# Altium schematic sheet 28Pins_schematic.SchDoc (part 1 of 2)
size A2; SheetNumber: 1; SheetTotal: 1
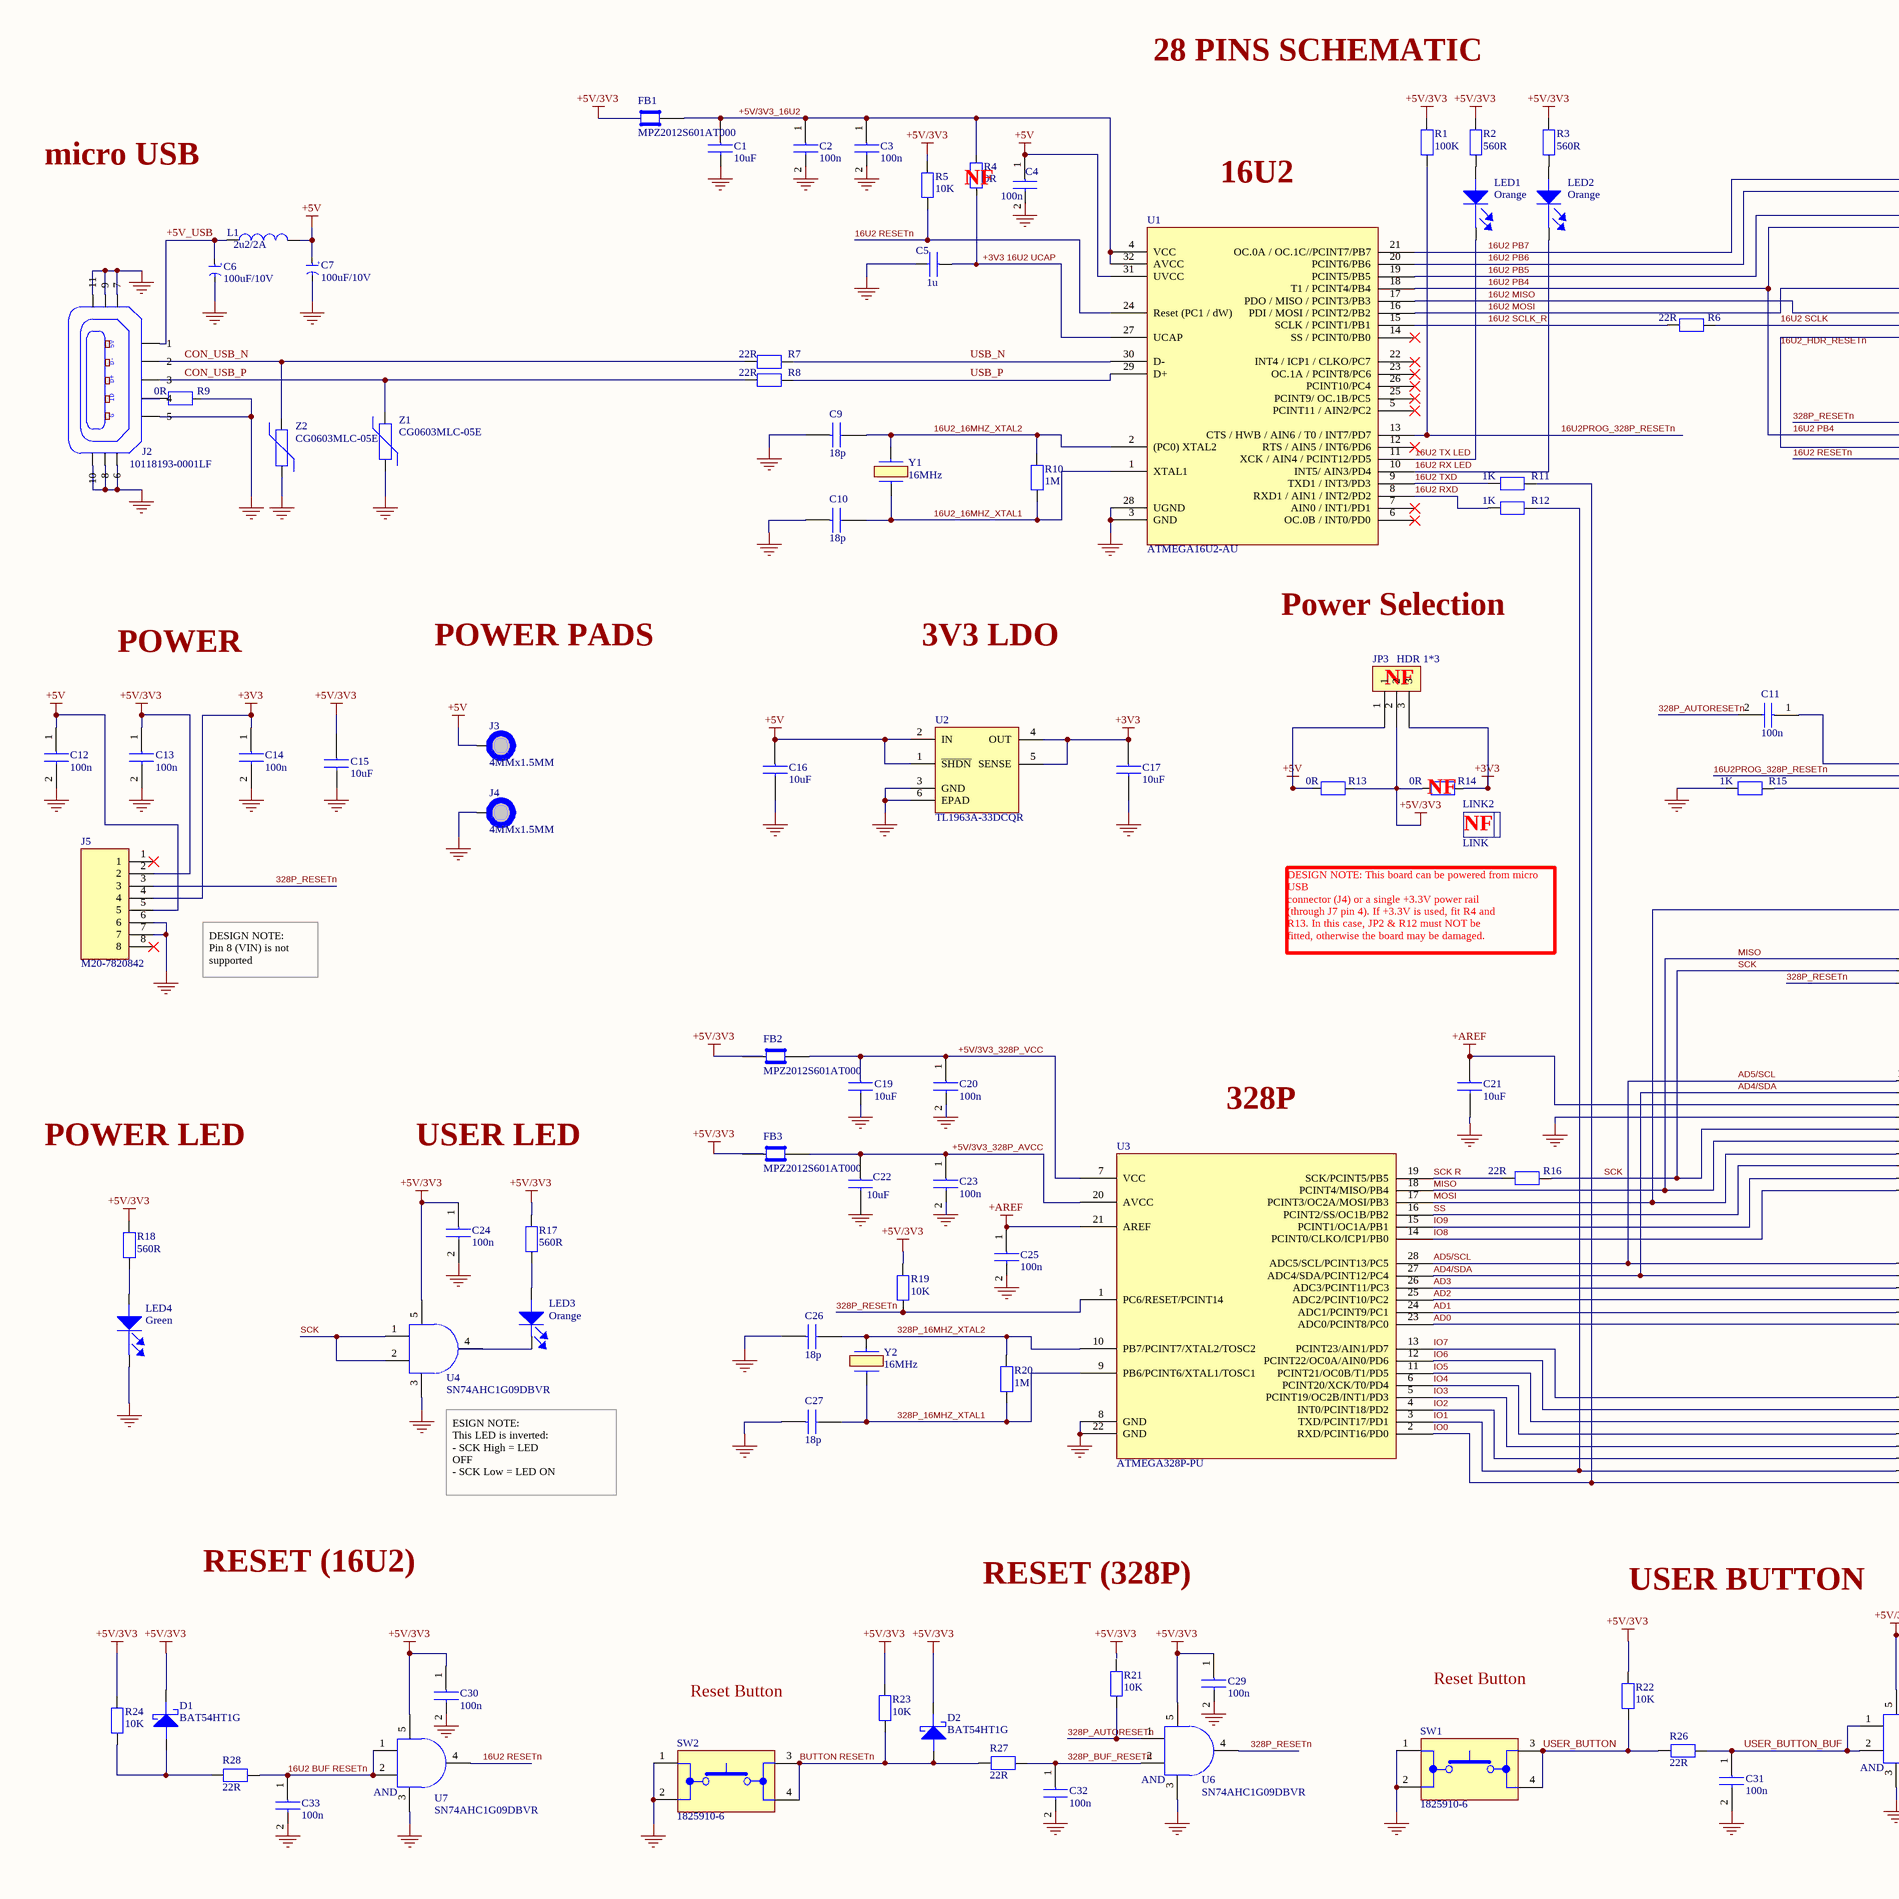
[diagram p0: 28Pins_schematic.SchDoc, left]
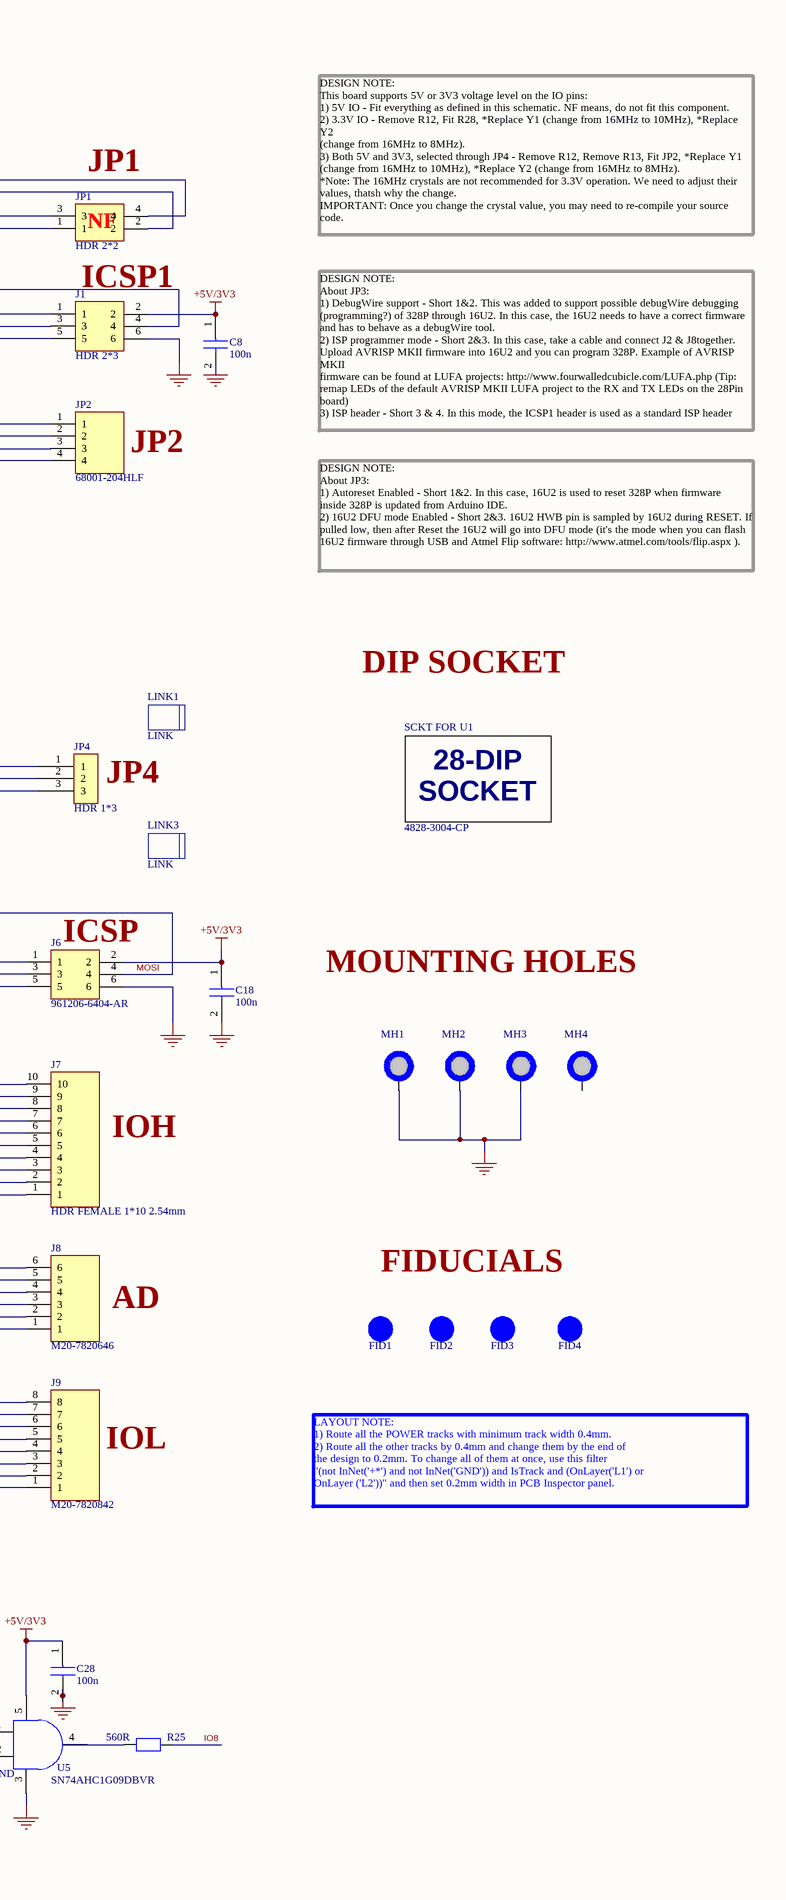
[diagram p1: 28Pins_schematic.SchDoc, right]

## Parts
C1  10uF  [CAP 0805_2012]
C2  100n  [CAPC2012X145N]
C3  100n  [CAPC2012X145N]
C4  100n  [CAPC2012X145N]
C5  1u  [CAP 0805_2012]
C6  100uF/10V  [EEE0GA101SR]
C7  100uF/10V  [EEE0GA101SR]
C8  100n  [CAPC2012X145N]
C9  18p  [CAP 0805_2012]
C10  18p  [CAP 0805_2012]
C11  100n  [CAPC2012X145N]
C12  100n  [CAPC2012X145N]
C13  100n  [CAPC2012X145N]
C14  100n  [CAPC2012X145N]
C15  10uF  [CAP 0805_2012]
C16  10uF  [CAP 0805_2012]
C17  10uF  [CAP 0805_2012]
C18  100n  [CAPC2012X145N]
C19  10uF  [CAP 0805_2012]
C20  100n  [CAPC2012X145N]
C21  10uF  [CAP 0805_2012]
C22  10uF  [CAP 0805_2012]
C23  100n  [CAPC2012X145N]
C24  100n  [CAPC2012X145N]
C25  100n  [CAPC2012X145N]
C26  18p  [CAP 0805_2012]
C27  18p  [CAP 0805_2012]
C28  100n  [CAPC2012X145N]
C29  100n  [CAPC2012X145N]
C30  100n  [CAPC2012X145N]
C31  100n  [CAPC2012X145N]
C32  100n  [CAPC2012X145N]
C33  100n  [CAPC2012X145N]
D1  BAT54HT1G  [SOD323]
D2  BAT54HT1G  [SOD323]
FB1  MPZ2012S601AT000  [FER 0805_2012]
FB2  MPZ2012S601AT000  [FER 0805_2012]
FB3  MPZ2012S601AT000  [FER 0805_2012]
FID1  FID_1MMC  [FID_40x120D]  (value not drawn)  (no BOM)
FID2  FID_1MMC  [FID_40x120D]  (value not drawn)  (no BOM)
FID3  FID_1MMC  [FID_40x120D]  (value not drawn)  (no BOM)
FID4  FID_1MMC  [FID_40x120D]  (value not drawn)  (no BOM)
J1  HDR 2*3  [HDRV6W64P254_2X3_762X500X1130P]
J2  10118193-0001LF  [FCI USB 10118193-0001LF]
J3  4MMx1.5MM  [PAD_WITH_HOLE_5MMx1.5MM]  (no BOM)
J4  4MMx1.5MM  [PAD_WITH_HOLE_5MMx1.5MM]  (no BOM)
J5  M20-7820842  [RHDR8W80P0X254_1X8_2032X254X850P]
J6  961206-6404-AR  [HDRV6W64P254_2X3_762X500X1130P]
J7  HDR FEMALE 1*10 2.54mm  [RHDR10W70P0X254_1X10_2580X250X865P]
J8  M20-7820646  [HDRV6W70P0X254_1X6_1564X250X865P]
J9  M20-7820842  [RHDR8W80P0X254_1X8_2032X254X850P]
JP1  HDR 2*2  [HDRV4W67P254_2X2_508X483X888P]
JP2  68001-204HLF  [HDRV4W67P0X254_1X4_1016X241X858P]
JP3  HDR 1*3  [HDR_1*3_2.54mm]
JP4  HDR 1*3  [HDR_1*3_2.54mm]
L1  2u2/2A  [INDC3225X270N]
LED1  Orange  [SODFL1708X67N]
LED2  Orange  [SODFL1708X67N]
LED3  Orange  [SODFL1708X67N]
LED4  Green  [LEDM178X67N]
LINK1  LINK  (mechanical)
LINK2  LINK  (mechanical)
LINK3  LINK  (mechanical)
MH1  MH_7.4MMC_3.2MMD  [MH_7.4MMD_3.2MMD]  (value not drawn)  (no BOM)
MH2  MH_7.4MMC_3.2MMD  [MH_7.4MMD_3.2MMD]  (value not drawn)  (no BOM)
MH3  MH_7.4MMC_3.2MMD  [MH_7.4MMD_3.2MMD]  (value not drawn)  (no BOM)
MH4  MH_7.4MMNC_3.2MMD  [MH_7.4MMD_3.2MMD_NON_COPPER_NPTH]  (value not drawn)  (no BOM)
R1  100K  [YAGEO RES 0805_2012]
R2  560R  [YAGEO RES 0805_2012]
R3  560R  [YAGEO RES 0805_2012]
R4  0R  [RESC2012X60N]
R5  10K  [CHIP RES_0603_1608]
R6  22R  [YAGEO RES 0805_2012]
R7  22R  [YAGEO RES 0805_2012]
R8  22R  [YAGEO RES 0805_2012]
R9  0R  [YAGEO RES 0805_2012]
R10  1M  [YAGEO RES 0805_2012]
R11  1K  [CHIP RES_0603_1608]
R12  1K  [CHIP RES_0603_1608]
R13  0R  [YAGEO RES 0805_2012]
R14  0R  [YAGEO RES 0805_2012]
R15  1K  [CHIP RES_0603_1608]
R16  22R  [YAGEO RES 0805_2012]
R17  560R  [RESC2012X60N]
R18  560R  [YAGEO RES 0805_2012]
R19  10K  [CHIP RES_0603_1608]
R20  1M  [YAGEO RES 0805_2012]
R21  10K  [CHIP RES_0603_1608]
R22  10K  [CHIP RES_0603_1608]
R23  10K  [CHIP RES_0603_1608]
R24  10K  [CHIP RES_0603_1608]
R25  560R  [RESC2012X60N]
R26  22R  [YAGEO RES 0805_2012]
R27  22R  [YAGEO RES 0805_2012]
R28  22R  [YAGEO RES 0805_2012]
SCKT_FOR_U1  4828-3004-CP  [28_DIP_7.62mm_SOCKET]
SW1  1825910-6  [18259106]
SW2  1825910-6  [18259106]
U1  ATMEGA16U2-AU  [TQFP32]
U2  TL1963A-33DCQR  [SOT127P706X180-6N]
U3  ATMEGA328P-PU  [28_DIP_7.62mm]
U4  SN74AHC1G09DBVR  [SOT95P280X145-5N]
U5  SN74AHC1G09DBVR  [SOT95P280X145-5N]
U6  SN74AHC1G09DBVR  [SOT95P280X145-5N]
U7  SN74AHC1G09DBVR  [SOT95P280X145-5N]
Y1  16MHz  [ABM7]
Y2  16MHz  [ABM7]
Z1  CG0603MLC-05E  [YAGEO RES 0603_1608]
Z2  CG0603MLC-05E  [YAGEO RES 0603_1608]

## Nets
+3V3: C14.1 C17.1 J5.4 JP3.3 R14.2 U2.4(OUT) U2.5(SENSE)
+5V: C4.1 C7.1 C12.1 C16.1 J5.5 JP3.1 L1.2 R13.1 U1.31(UVCC) U2.1(~{SHDN}) U2.2(IN)
+5V/3V3: C8.1 C13.1 C15.1 C18.1 C24.1 C28.1 C29.1 C30.1 D1.2(A) D2.2(A) FB1.2 J1.2 J5.2 J6.2 JP3.2 R1.2 R2.2 R3.2 R5.2 R13.2 R14.1 R17.2 R18.2 R19.2 R22.2 R23.2 R24.2
+AREF: C21.1 C25.1 J7.8 U3.21(AREF)
GND: C5.2 C6.2 C7.2 C8.2 C9.1 C10.1 C12.2 C13.2 C14.2 C16.2 C17.2 C18.2 C19.2 C20.2 C21.2 C23.2 C24.2 C26.1 C27.1 C28.2 C31.2 J1.6 J5.6 J5.7 J6.6 J7.7 LED4.2(A) R9.2 R15.1 SW1.1(COM_1) SW1.2(NO_1) SW2.1(COM_1) SW2.2(NO_1) U1.3(GND) U1.28(UGND) U2.3(GND) U2.6(EPAD) U3.8(GND) U3.22(GND) Z1.1 Z2.1
16U2 BUF RESETn: C33.1 R28.2 U7.1(A) U7.2(B)
16U2 MISO: J1.1 U1.17(PDO_/_MISO_/_PCINT3/PB3)
16U2 MOSI: J1.4 U1.16(PDI_/_MOSI_/_PCINT2/PB2)
16U2 PB4: JP1.1 JP2.2 U1.18(T1_/_PCINT4/PB4)
16U2 PB5: JP1.3 U1.19(PCINT5/PB5)
16U2 PB6: JP1.2 U1.20(PCINT6/PB6)
16U2 PB7: JP1.4 U1.21(OC.0A_/_OC.1C//PCINT7/PB7)
16U2 RESETn: JP2.4 R5.1 U1.24(Reset_(PC1_/_dW))
16U2 RX LED: LED2.2(A) U1.10(INT5/_AIN3/PD4)
16U2 RXD: R12.1 U1.8(RXD1_/_AIN1_/_INT2/PD2)
16U2 SCLK: J1.3 R6.2
16U2 SCLK_R: R6.1 U1.15(SCLK_/_PCINT1/PB1)
16U2 TX LED: LED1.2(A) U1.11(XCK_/_AIN4_/_PCINT12/PD5)
16U2 TXD: R11.1 U1.9(TXD1_/_INT3/PD3)
16U2_16MHZ_XTAL1: C10.2 R10.1 U1.1(XTAL1) Y1.2(X2)
16U2_16MHZ_XTAL2: C9.2 R10.2 U1.2((PC0)_XTAL2) Y1.?1
16U2_HDR_RESETn: J1.5 JP2.3
16U2PROG_328P_RESETn: JP4.2 R1.1 U1.13(CTS_/_HWB_/_AIN6_/_T0_/_INT7/PD7)
328P_16MHZ_XTAL1: C27.2 R20.1 U3.9(PB6/PCINT6/XTAL1/TOSC1) Y2.2(X2)
328P_16MHZ_XTAL2: C26.2 R20.2 U3.10(PB7/PCINT7/XTAL2/TOSC2) Y2.?1
328P_AUTORESETn: C11.2 R21.1 U6.1(A)
328P_BUF_RESETn: C32.1 R27.2 U6.2(B)
328P_RESETn: J5.3 J6.5 JP2.1 R19.1 U3.1(PC6/RESET/PCINT14)
+3V3 16U2 UCAP: C5.1 R4.2 U1.27(UCAP)
+5V/3V3_16U2: C1.1 C2.1 C3.1 FB1.1 R4.1 U1.4(VCC) U1.32(AVCC)
+5V/3V3_328P_AVCC: C22.1 C23.1 FB3.1 U3.20(AVCC)
+5V/3V3_328P_VCC: C19.1 C20.1 FB2.1 U3.7(VCC)
+5V_USB: C6.1 L1.1
AD0: J8.1 U3.23(ADC0/PCINT8/PC0)
AD1: J8.2 U3.24(ADC1/PCINT9/PC1)
AD2: J8.3 U3.25(ADC2/PCINT10/PC2)
AD3: J8.4 U3.26(ADC3/PCINT11/PC3)
AD4/SDA: J7.9 J8.5 U3.27(ADC4/SDA/PCINT12/PC4)
AD5/SCL: J7.10 J8.6 U3.28(ADC5/SCL/PCINT13/PC5)
BUTTON RESETn: D2.1(K) R23.1 R27.1 SW2.3(COM_2) SW2.4(NO_2)
CON_USB_N: R7.1 Z2.2
CON_USB_P: R8.1 Z1.2
IO0: J9.1 R11.2 U3.2(RXD/PCINT16/PD0)
IO1: J9.2 R12.2 U3.3(TXD/PCINT17/PD1)
IO2: J9.3 U3.4(INT0/PCINT18/PD2)
IO3: J9.4 U3.5(PCINT19/OC2B/INT1/PD3)
IO4: J9.5 U3.6(PCINT20/XCK/T0/PD4)
IO5: J9.6 U3.11(PCINT21/OC0B/T1/PD5)
IO6: J9.7 U3.12(PCINT22/OC0A/AIN0/PD6)
IO7: J9.8 U3.13(PCINT23/AIN1/PD7)
IO8: J7.1 R25.2 U3.14(PCINT0/CLKO/ICP1/PB0)
IO9: J7.2 U3.15(PCINT1/OC1A/PB1)
MISO: J6.1 J7.5 U3.18(PCINT4/MISO/PB4)
MOSI: J6.4 J7.4 U3.17(PCINT3/OC2A/MOSI/PB3)
SCK: J6.3 J7.6 R16.2 U4.1(A) U4.2(B)
SCK R: R16.1 U3.19(SCK/PCINT5/PB5)
SS: J7.3 U3.16(PCINT2/SS/OC1B/PB2)
USB_N: R7.2 U1.30(D-)
USB_P: R8.2 U1.29(D+)
USER_BUTTON: R22.1 R26.1 SW1.3(COM_2) SW1.4(NO_2)
USER_BUTTON_BUF: C31.1 R26.2 U5.1(A) U5.2(B)
NetC11_1: C11.1 JP4.1
NetD1_1: D1.1(K) R24.1 R28.1
NetJ2_4: J2.4 R9.1
NetJP4_3: JP4.3 R15.2
NetLED1_1: LED1.1(K) R2.1
NetLED2_1: LED2.1(K) R3.1
NetLED3_1: LED3.1(K) R17.1
NetLED3_2: LED3.2(A) U4.4(Y)
NetLED4_1: LED4.1(K) R18.1
NetR25_1: R25.1 U5.4(Y)

Not connected (* = marked no-connect by the designer): C1 2; C2 2; C3 2; C4 2; C15 2; C22 2; C25 2; C29 2; C30 2; C32 2; C33 2; FB2 2; FB3 2; J2 1 2 3 5 6 7 8 9 10 11; J3 1; J4 1; J5 1* 8*; MH1 1; MH2 1; MH3 1; MH4 1; R21 2; U1 5(PCINT11_/_AIN2/PC2)* 6(OC.0B_/_INT0/PD0)* 7(AIN0_/_INT1/PD1)* 12(RTS_/_AIN5_/_INT6/PD6)* 14(SS_/_PCINT0/PB0)* 22(INT4_/_ICP1_/_CLKO/PC7)* 23(OC.1A_/_PCINT8/PC6)* 25(PCINT9/_OC.1B/PC5)* 26(PCINT10/PC4)*; U4 3(GND) 5(VCC); U5 3(GND) 5(VCC); U6 3(GND) 4(Y) 5(VCC); U7 3(GND) 4(Y) 5(VCC)

## Notes on the sheet
- 28 PINS SCHEMATIC
- micro USB
- (near R4) NF
- 16U2
- (near JP1) JP1
- (near JP1) NF
- DESIGN NOTE:
  This board supports 5V or 3V3 voltage level on the IO pins:
  1) 5V IO - Fit everything as defined in this schematic. NF means, do not fit this component.
  2) 3.3V IO - Remove R12, Fit R28, *Replace Y1 (change from 16MHz to 10MHz), *Replace Y2
  (change from 16MHz to 8MHz).
  3) Both 5V and 3V3, selected through JP4 - Remove R12, Remove R13, Fit JP2, *Replace Y1
  (change from 16MHz to 10MHz), *Replace Y2 (change from 16MHz to 8MHz).
  *Note: The 16MHz crystals are not recommended for 3.3V operation. We need to adjust their
  values, thatsh why the change.
  IMPORTANT: Once you change the crystal value, you may need to re-compile your source
  code.
- ICSP1
- JP2
- DESIGN NOTE:
  About JP3:
  1) DebugWire support - Short 1&2. This was added to support possible debugWire debugging
  (programming?) of 328P through 16U2. In this case, the 16U2 needs to have a correct firmware
  and has to behave as a debugWire tool.
  2) ISP programmer mode - Short 2&3. In this case, take a cable and connect J2 & J8together.
  Upload AVRISP MKII firmware into 16U2 and you can program 328P. Example of AVRISP MKII
  firmware can be found at LUFA projects: http://www.fourwalledcubicle.com/LUFA.php (Tip:
  remap LEDs of the default AVRISP MKII LUFA project to the RX and TX LEDs on the 28Pin
  board)
  3) ISP header - Short 3 & 4. In this mode, the ICSP1 header is used as a standard ISP header
- DESIGN NOTE:
  About JP3:
  1) Autoreset Enabled - Short 1&2. In this case, 16U2 is used to reset 328P when firmware
  inside 328P is updated from Arduino IDE.
  2) 16U2 DFU mode Enabled - Short 2&3. 16U2 HWB pin is sampled by 16U2 during RESET. If
  pulled low, then after Reset the 16U2 will go into DFU mode (it's the mode when you can flash
  16U2 firmware through USB and Atmel Flip software: http://www.atmel.com/tools/flip.aspx ).
- Power Selection
- POWER
- POWER PADS
- 3V3 LDO
- (near JP3) NF
- DIP SOCKET
- (near R14) NF
- JP4
- (near LINK2) NF
- (near LINK2) DESIGN NOTE: This board can be powered from micro USB
  connector (J4) or a single +3.3V power rail
  (through J7 pin 4). If +3.3V is used, fit R4 and
  R13. In this case, JP2 & R12 must NOT be
  fitted, otherwise the board may be damaged.
- (near J6) ICSP
- DESIGN NOTE:
  Pin 8 (VIN) is not
  supported
- MOUNTING HOLES
- 328P
- POWER LED
- USER LED
- IOH
- AD
- FIDUCIALS
- (near U4) ESIGN NOTE:
  This LED is inverted:
  - SCK High = LED
  OFF
  - SCK Low = LED ON
- IOL
- LAYOUT NOTE:
  1) Route all the POWER tracks with minimum track width 0.4mm.
  2) Route all the other tracks by 0.4mm and change them by the end of
  the design to 0.2mm. To change all of them at once, use this filter
  "(not InNet('+*') and not InNet('GND')) and IsTrack and (OnLayer('L1') or
  OnLayer ('L2'))" and then set 0.2mm width in PCB Inspector panel.
- RESET (16U2)
- RESET (328P)
- USER BUTTON
- Reset Button
- (near U7) AND
- (near U6) AND
- (near U5) AND
- Labels drawn without touching a wire or pin: GND
- (in symbol 4828-3004-CP) 28-DIP; SOCKET
- (in symbol 10118193-0001LF) 5V; D-; D+; ID; G
- (in symbol EEE-1AA101WR) +